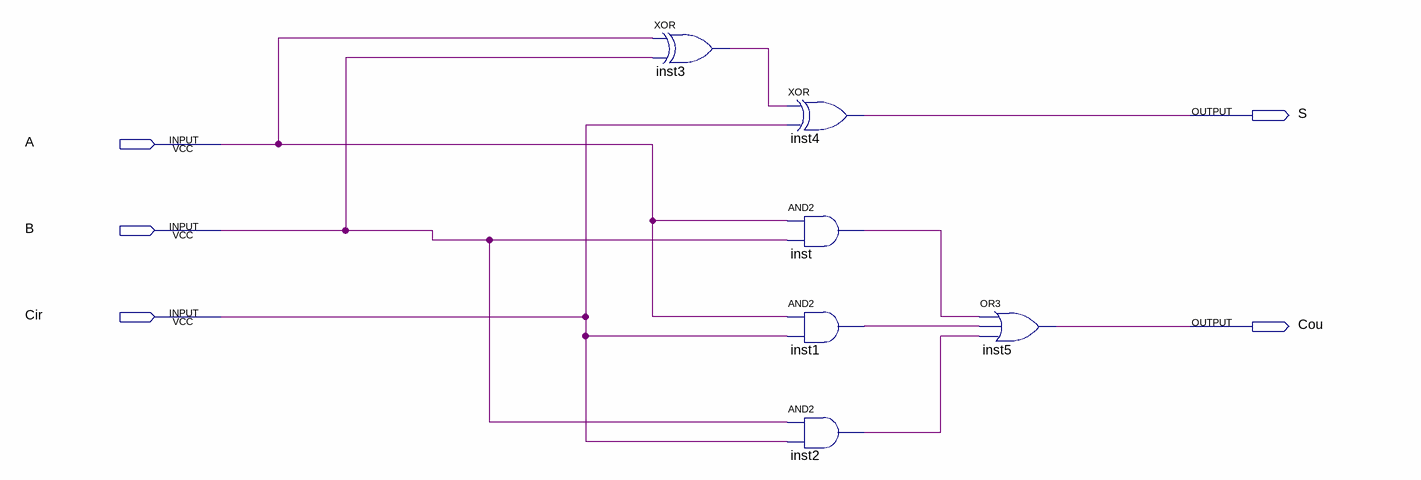
[diagram p0: schematic sheet]
// Quartus schematic Block2.bdf as structural Verilog: 6 symbols, 5 pins
module Block2 (
  input  A,
  input  B,
  input  Cir,
  output S,
  output Cou
);

  wire inst1_out, inst2_out, inst3_out, inst_out;

  xor inst3 (inst3_out, A, B);
  xor inst4 (S, inst3_out, Cir);
  and inst (inst_out, A, B);
  and inst1 (inst1_out, A, Cir);
  and inst2 (inst2_out, B, Cir);
  or inst5 (Cou, inst_out, inst1_out, inst2_out);
endmodule
